# Altium project Ravage.PrjPcb (part 2 of 2)

## Sheet Core Analogue Inputs.SchDoc: Ravage - Core Analogue Inputs
size A4; Address1: Drawn By:; Address2: Dan Visser; DocumentNumber: A; Revision: 0.1-alpha; SheetNumber: 6; SheetTotal: 16
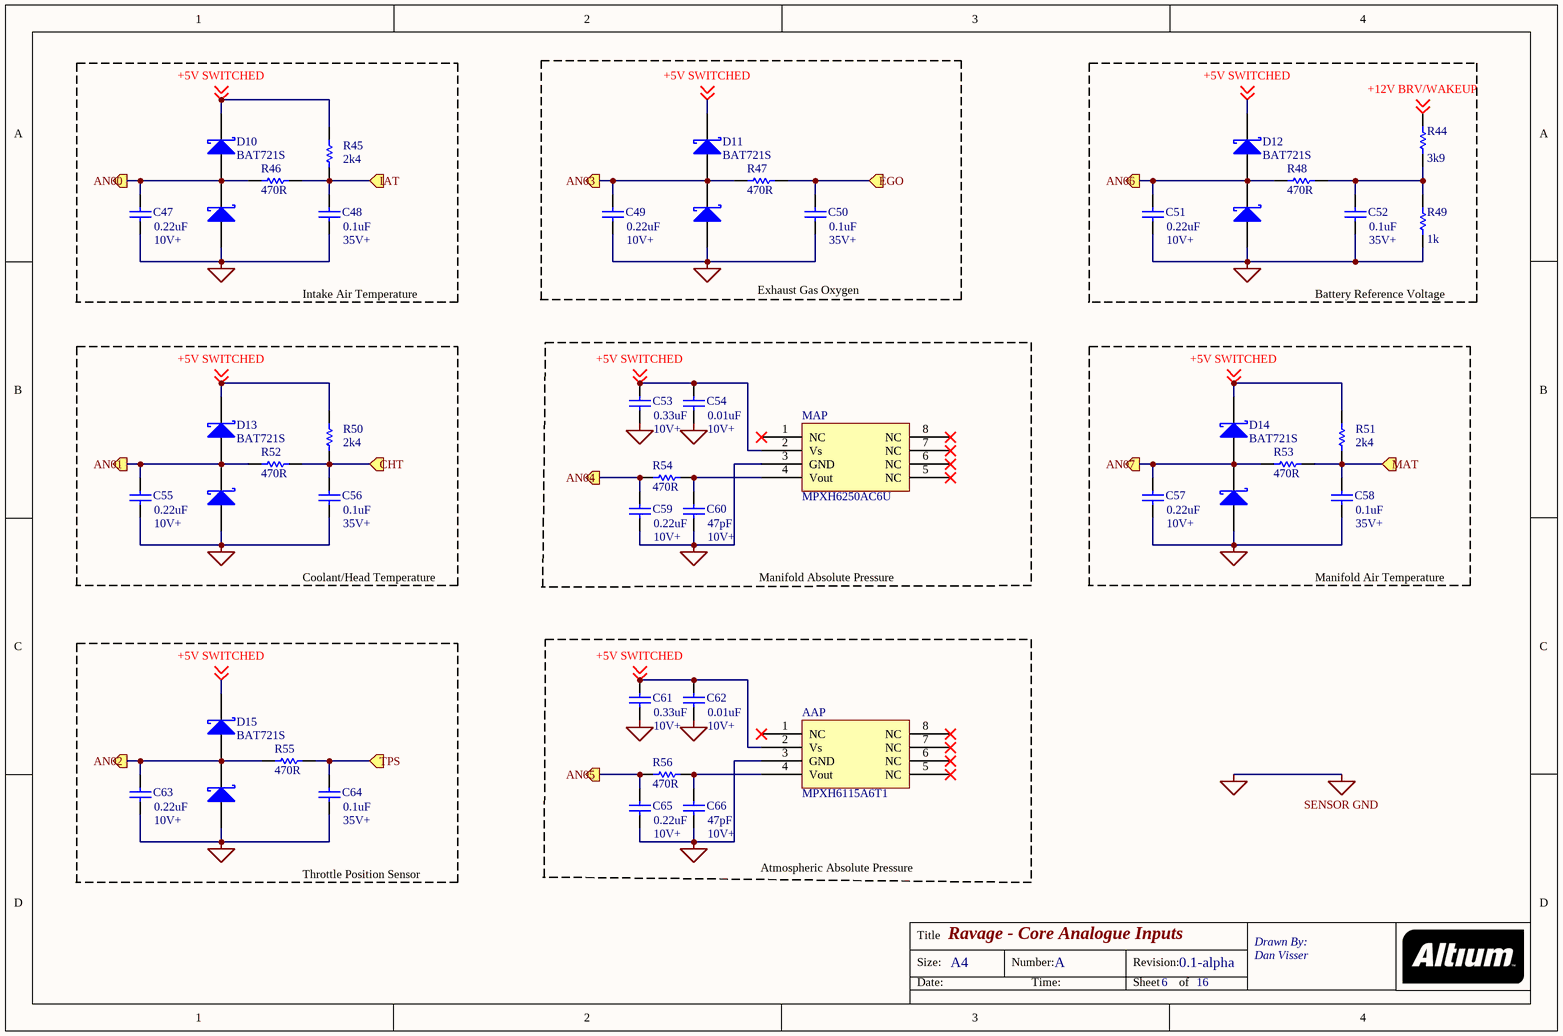
[diagram p10: Core Analogue Inputs.SchDoc]

### Parts
AAP  MPXH6115A6T1
C47  value 0.22uF  [RAD-0.3]
C48  value 0.1uF  [RAD-0.3]
C49  value 0.22uF  [RAD-0.3]
C50  value 0.1uF  [RAD-0.3]
C51  value 0.22uF  [RAD-0.3]
C52  value 0.1uF  [RAD-0.3]
C53  value 0.33uF  [RAD-0.3]
C54  value 0.01uF  [RAD-0.3]
C55  value 0.22uF  [RAD-0.3]
C56  value 0.1uF  [RAD-0.3]
C57  value 0.22uF  [RAD-0.3]
C58  value 0.1uF  [RAD-0.3]
C59  value 0.22uF  [RAD-0.3]
C60  value 47pF  [RAD-0.3]
C61  value 0.33uF  [RAD-0.3]
C62  value 0.01uF  [RAD-0.3]
C63  value 0.22uF  [RAD-0.3]
C64  value 0.1uF  [RAD-0.3]
C65  value 0.22uF  [RAD-0.3]
C66  value 47pF  [RAD-0.3]
D10  BAT721S
D11  BAT721S
D12  BAT721S
D13  BAT721S
D14  BAT721S
D15  BAT721S
MAP  MPXH6250AC6U
R44  value 3k9  [AXIAL-0.3]
R45  value 2k4  [AXIAL-0.3]
R46  value 470R  [AXIAL-0.3]
R47  value 470R  [AXIAL-0.3]
R48  value 470R  [AXIAL-0.3]
R49  value 1k  [AXIAL-0.3]
R50  value 2k4  [AXIAL-0.3]
R51  value 2k4  [AXIAL-0.3]
R52  value 470R  [AXIAL-0.3]
R53  value 470R  [AXIAL-0.3]
R54  value 470R  [AXIAL-0.3]
R55  value 470R  [AXIAL-0.3]
R56  value 470R  [AXIAL-0.3]

### Ports
AN00 (out), AN01 (out), AN02 (out), AN03 (out), AN04 (out), AN05 (out), AN06 (out), AN07 (out), CHT (in), EGO (in), IAT (in), MAT (in), TPS (in)

### Nets
SENSOR GND: AAP.3(GND) C47.1 C48.1 C49.1 C50.1 C51.1 C52.1 C53.1 C54.1 C55.1 C56.1 C57.1 C58.1 C59.1 C60.1 C61.1 C62.1 C63.1 C64.1 C65.1 C66.1 D10.1(A) D11.1(A) D12.1(A) D13.1(A) D14.1(A) D15.1(A) MAP.3(GND) R49.1
+5V SWITCHED: AAP.2(Vs) C53.2 C54.2 C61.2 C62.2 D10.2(K) D11.2(K) D12.2(K) D13.2(K) D14.2(K) D15.2(K) MAP.2(Vs) R45.1 R50.1 R51.1 ; off-sheet +5V SWITCHED
+12V BRV/WAKEUP: R44.2 ; off-sheet +12V BRV/WAKEUP
AN00: C47.2 D10.3(A2) R46.1 ; port AN00
AN01: C55.2 D13.3(A2) R52.1 ; port AN01
AN02: C63.2 D15.3(A2) R55.1 ; port AN02
AN03: C49.2 D11.3(A2) R47.1 ; port AN03
AN04: C59.2 R54.1 ; port AN04
AN05: C65.2 R56.1 ; port AN05
AN06: C51.2 D12.3(A2) R48.1 ; port AN06
AN07: C57.2 D14.3(A2) R53.1 ; port AN07
CHT: C56.2 R50.2 R52.2 ; port CHT
EGO: C50.2 R47.2 ; port EGO
IAT: C48.2 R45.2 R46.2 ; port IAT
MAT: C58.2 R51.2 R53.2 ; port MAT
TPS: C64.2 R55.2 ; port TPS
NetAAP_4: AAP.4(Vout) C66.2 R56.2
NetC52_2: C52.2 R44.1 R48.2 R49.2
NetC60_2: C60.2 MAP.4(Vout) R54.2

Not connected (* = marked no-connect by the designer): AAP 1(NC)* 5(NC)* 6(NC)* 7(NC)* 8(NC)*; MAP 1(NC)* 5(NC)* 6(NC)* 7(NC)* 8(NC)*

### Notes on the sheet
- (near C47) 10V+
- (near C48) 35V+
- (near C49) 10V+
- (near C50) 35V+
- (near C51) 10V+
- 35V+
- Intake Air Temperature
- Exhaust Gas Oxygen
- Battery Reference Voltage
- 10V+
- (near C54) 10V+
- (near C55) 10V+
- Coolant/Head Temperature
- (near C56) 35V+
- (near C60) 10V+
- Manifold Absolute Pressure
- (near C57) 10V+
- Manifold Air Temperature
- (near C58) 35V+
- (near C62) 10V+
- (near C63) 10V+
- (near C64) 35V+
- (near C66) 10V+
- Throttle Position Sensor
- Atmospheric Absolute Pressure
- Title
- Size:
- Date:
- A4
- Number:
- Time:
- Revision:
- Sheet
- of

### Library data of the parts
C47-C66 = Cap: Capacitor; Published: 8-Jun-2000; LatestRevisionDate: 17-Jul-2002; LatestRevisionNote: Re-released for DXP Platform.; PackageReference: RAD-0.3; Publisher: Altium Limited; PackageDescription: Radial Cap, Thru-Hole; 2 Leads; 0.3 in Pin Spacing
D10-D15 = BAT721S: DUAL SCHOTTKY DIODE
R44-R56 = Res1: Resistor; Published: 8-Jun-2000; LatestRevisionDate: 17-Jul-2002; LatestRevisionNote: Re-released for DXP Platform.; PackageReference: AXIAL-0.3; Publisher: Altium Limited; PackageDescription: Axial Device, Thru-Hole; 2 Leads; 0.3 in Pin Spacing

## Sheet Extra Analogue Inputs.SchDoc: Ravage - Extra Analogue Inputs
size A4; Address1: Drawn By:; Address2: Dan Visser; DocumentNumber: A; Revision: 0.1-alpha; SheetNumber: 7; SheetTotal: 16
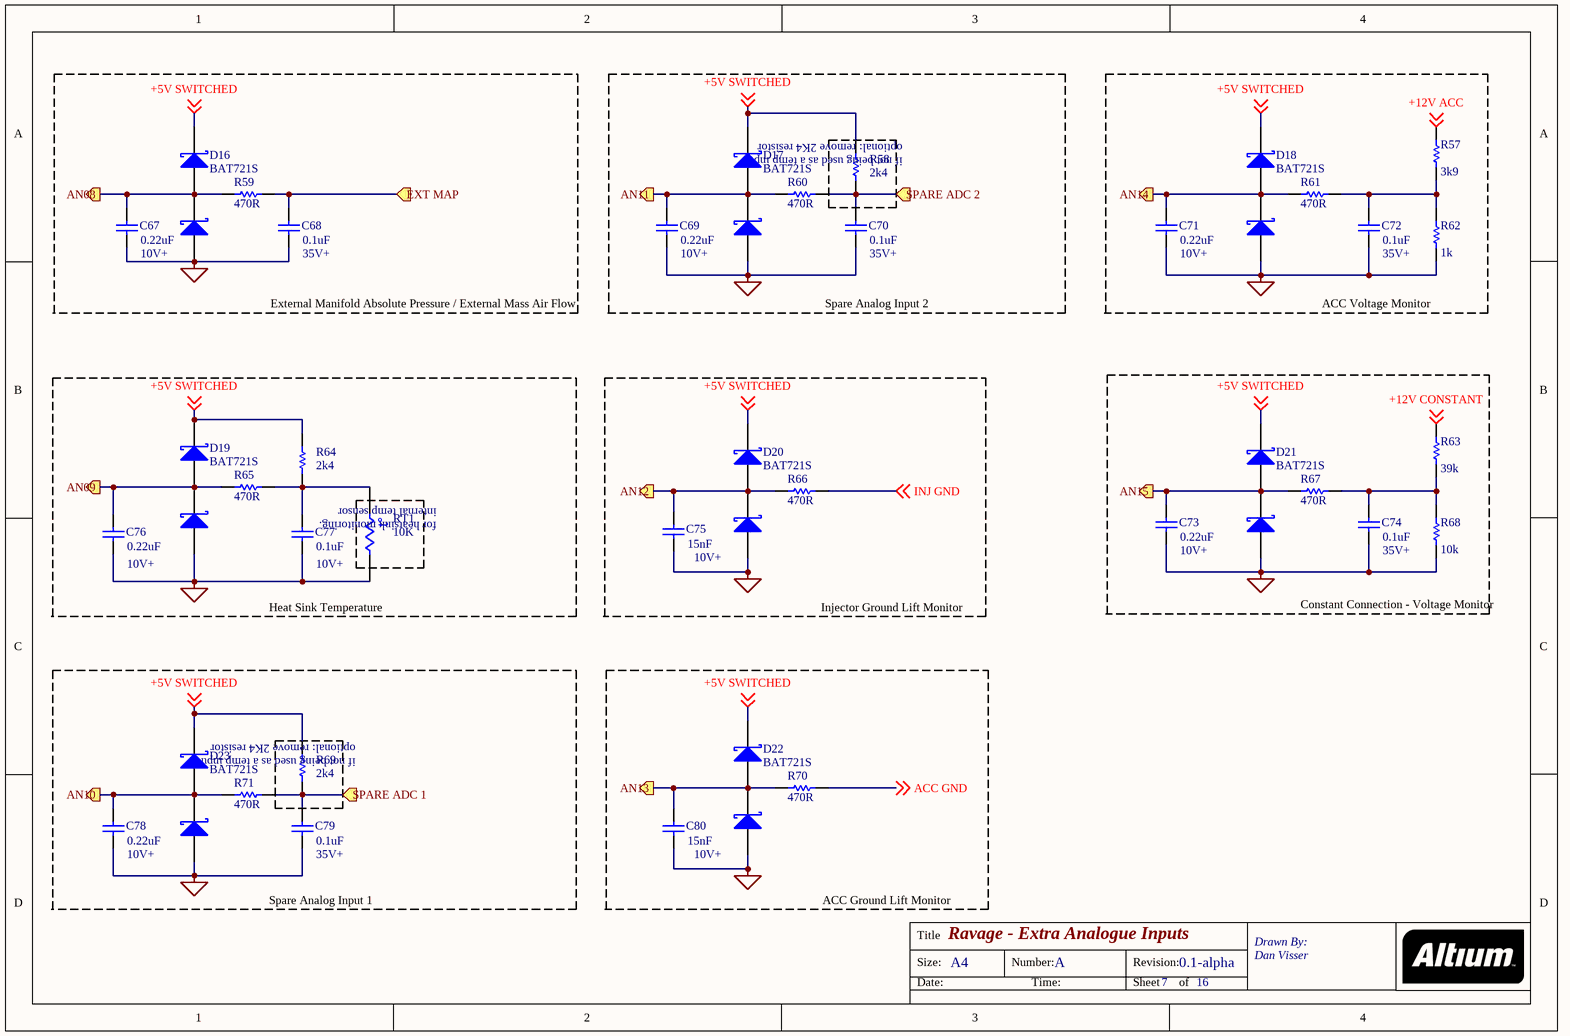
[diagram p11: Extra Analogue Inputs.SchDoc]

### Parts
C67  value 0.22uF  [RAD-0.3]
C68  value 0.1uF  [RAD-0.3]
C69  value 0.22uF  [RAD-0.3]
C70  value 0.1uF  [RAD-0.3]
C71  value 0.22uF  [RAD-0.3]
C72  value 0.1uF  [RAD-0.3]
C73  value 0.22uF  [RAD-0.3]
C74  value 0.1uF  [RAD-0.3]
C75  value 15nF  [RAD-0.3]
C76  value 0.22uF  [RAD-0.3]
C77  value 0.1uF  [RAD-0.3]
C78  value 0.22uF  [RAD-0.3]
C79  value 0.1uF  [RAD-0.3]
C80  value 15nF  [RAD-0.3]
D16  BAT721S
D17  BAT721S
D18  BAT721S
D19  BAT721S
D20  BAT721S
D21  BAT721S
D22  BAT721S
D23  BAT721S
R57  value 3k9  [AXIAL-0.3]
R58  value 2k4  [AXIAL-0.3]
R59  value 470R  [AXIAL-0.3]
R60  value 470R  [AXIAL-0.3]
R61  value 470R  [AXIAL-0.3]
R62  value 1k  [AXIAL-0.3]
R63  value 39k  [AXIAL-0.3]
R64  value 2k4  [AXIAL-0.3]
R65  value 470R  [AXIAL-0.3]
R66  value 470R  [AXIAL-0.3]
R67  value 470R  [AXIAL-0.3]
R68  value 10k  [AXIAL-0.3]
R69  value 2k4  [AXIAL-0.3]
R70  value 470R  [AXIAL-0.3]
R71  value 470R  [AXIAL-0.3]
RT1  10K  [6-0805_N]

### Ports
AN08 (out), AN09 (out), AN10 (out), AN11 (out), AN12 (out), AN13 (out), AN14 (out), AN15 (out), EXT MAP (in), SPARE ADC 1 (in), SPARE ADC 2 (in)

### Nets
SENSOR GND: C67.1 C68.1 C69.1 C70.1 C71.1 C72.1 C73.1 C74.1 C75.1 C76.1 C77.1 C78.1 C79.1 C80.1 D16.1(A) D17.1(A) D18.1(A) D19.1(A) D20.1(A) D21.1(A) D22.1(A) D23.1(A) R62.1 R68.1 RT1.2
+5V SWITCHED: D16.2(K) D17.2(K) D18.2(K) D19.2(K) D20.2(K) D21.2(K) D22.2(K) D23.2(K) R58.1 R64.1 R69.1 ; off-sheet +5V SWITCHED
+12V ACC: R57.2 ; off-sheet +12V ACC
+12V CONSTANT: R63.2 ; off-sheet +12V CONSTANT
ACC GND: R70.2 ; off-sheet ACC GND
AN08: C67.2 D16.3(A2) R59.1 ; port AN08
AN09: C76.2 D19.3(A2) R65.1 ; port AN09
AN10: C78.2 D23.3(A2) R71.1 ; port AN10
AN11: C69.2 D17.3(A2) R60.1 ; port AN11
AN12: C75.2 D20.3(A2) R66.1 ; port AN12
AN13: C80.2 D22.3(A2) R70.1 ; port AN13
AN14: C71.2 D18.3(A2) R61.1 ; port AN14
AN15: C73.2 D21.3(A2) R67.1 ; port AN15
EXT MAP: C68.2 R59.2 ; port EXT MAP
INJ GND: R66.2 ; off-sheet INJ GND
SPARE ADC 1: C79.2 R69.2 R71.2 ; port SPARE ADC 1
SPARE ADC 2: C70.2 R58.2 R60.2 ; port SPARE ADC 2
NetC72_2: C72.2 R57.1 R61.2 R62.2
NetC74_2: C74.2 R63.1 R67.2 R68.2
NetC77_2: C77.2 R64.2 R65.2 RT1.1

### Notes on the sheet
- (near R58) optional: remove 2K4 resistor
- if not being used as a temp input.
- 10V+
- External Manifold Absolute Pressure / External Mass Air Flow
- (near C68) 35V+
- (near C69) 10V+
- Spare Analog Input 2
- (near C70) 35V+
- (near C71) 10V+
- ACC Voltage Monitor
- 35V+
- internal temp sensor
- for heatsink monitoring.
- (near C76) 10V+
- (near C73) 10V+
- Heat Sink Temperature
- Injector Ground Lift Monitor
- Constant Connection - Voltage Monitor
- optional: remove 2K4 resistor
- (near C78) 10V+
- Spare Analog Input 1
- (near C79) 35V+
- ACC Ground Lift Monitor
- Title
- Size:
- Date:
- A4
- Number:
- Time:
- Revision:
- Sheet
- of
- (in symbol Res Thermal) t°

### Library data of the parts
C67-C80 = Cap: Capacitor; Published: 8-Jun-2000; LatestRevisionDate: 17-Jul-2002; LatestRevisionNote: Re-released for DXP Platform.; PackageReference: RAD-0.3; Publisher: Altium Limited; PackageDescription: Radial Cap, Thru-Hole; 2 Leads; 0.3 in Pin Spacing
D16-D23 = BAT721S: DUAL SCHOTTKY DIODE
R57-R71 = Res1: Resistor; Published: 8-Jun-2000; LatestRevisionDate: 17-Jul-2002; LatestRevisionNote: Re-released for DXP Platform.; PackageReference: AXIAL-0.3; Publisher: Altium Limited; PackageDescription: Axial Device, Thru-Hole; 2 Leads; 0.3 in Pin Spacing
RT1 = Res Thermal: Thermistor; Published: 24-Mar-1999; LatestRevisionDate: 29-May-2009; LatestRevisionNote: IPC-7351 Footprint Added.; PackageVersion: Mar-2003; PackageReference: 6-0805; Publisher: Altium Limited; PackageDescription: Chip Resistor 0805 Case Size; Code_IPC: RESC2012

## Sheet Low Side Drivers.SchDoc: Ravage - Low Side Drivers
size A4; Address1: Drawn By:; Address2: Dan Visser; DocumentNumber: A; Revision: 0.1-alpha; SheetNumber: 12; SheetTotal: 16
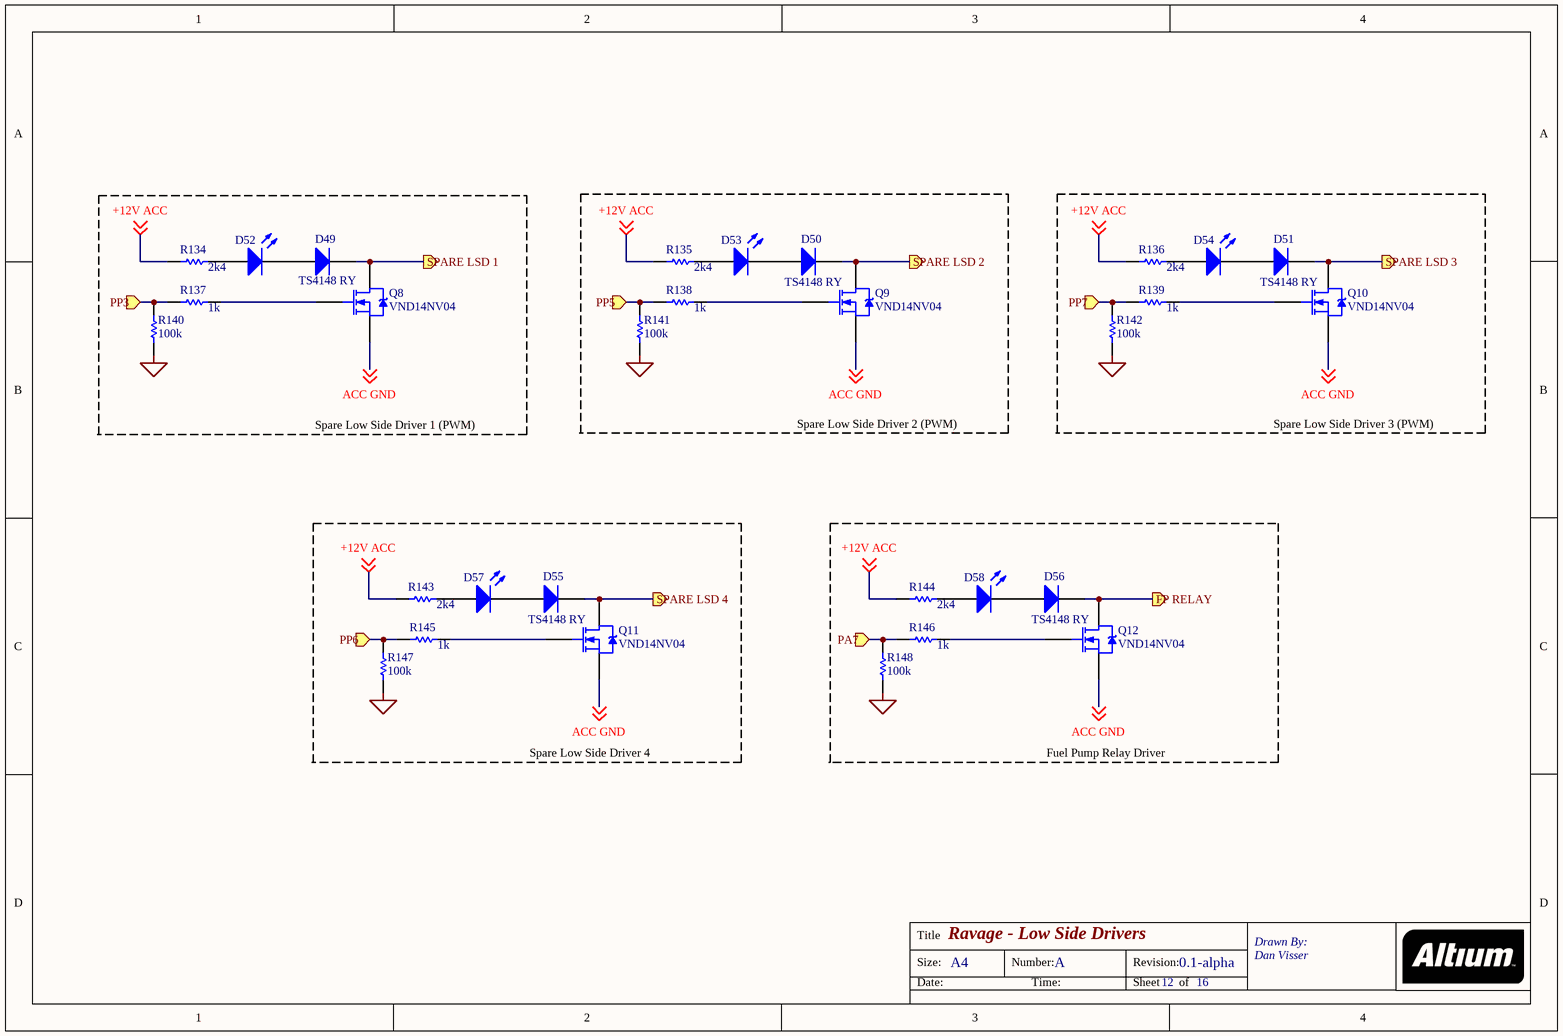
[diagram p12: Low Side Drivers.SchDoc]

### Parts
D49  TS4148 RY  [SMC]
D50  TS4148 RY  [SMC]
D51  TS4148 RY  [SMC]
D52  (no value)  [LED-0]
D53  (no value)  [LED-0]
D54  (no value)  [LED-0]
D55  TS4148 RY  [SMC]
D56  TS4148 RY  [SMC]
D57  (no value)  [LED-0]
D58  (no value)  [LED-0]
Q8  VND14NV04  [TO-220AB]
Q9  VND14NV04  [TO-220AB]
Q10  VND14NV04  [TO-220AB]
Q11  VND14NV04  [TO-220AB]
Q12  VND14NV04  [TO-220AB]
R134  value 2k4  [AXIAL-0.3]
R135  value 2k4  [AXIAL-0.3]
R136  value 2k4  [AXIAL-0.3]
R137  value 1k  [AXIAL-0.3]
R138  value 1k  [AXIAL-0.3]
R139  value 1k  [AXIAL-0.3]
R140  value 100k  [AXIAL-0.3]
R141  value 100k  [AXIAL-0.3]
R142  value 100k  [AXIAL-0.3]
R143  value 2k4  [AXIAL-0.3]
R144  value 2k4  [AXIAL-0.3]
R145  value 1k  [AXIAL-0.3]
R146  value 1k  [AXIAL-0.3]
R147  value 100k  [AXIAL-0.3]
R148  value 100k  [AXIAL-0.3]

### Blocks framed on the sheet
Spare Low Side Driver 2 (PWM): D50 D53 Q9 R135 R138 R141
Spare Low Side Driver 3 (PWM): D51 D54 Q10 R136 R139 R142
Spare Low Side Driver 1 (PWM): D49 D52 Q8 R134 R137 R140
Spare Low Side Driver 4: D55 D57 Q11 R143 R145 R147
Fuel Pump Relay Driver: D56 D58 Q12 R144 R146 R148

### Ports
FP RELAY (out), PA7 (in), PP3 (in), PP5 (in), PP6 (in), PP7 (in), SPARE LSD 1 (out), SPARE LSD 2 (out), SPARE LSD 3 (out), SPARE LSD 4 (out)

### Nets
SENSOR GND: R140.1 R141.1 R142.1 R147.1 R148.1
+12V ACC: R134.1 R135.1 R136.1 R143.1 R144.1 ; off-sheet +12V ACC
ACC GND: Q8.3(S) Q9.3(S) Q10.3(S) Q11.3(S) Q12.3(S) ; off-sheet ACC GND
FP RELAY: D56.2(K) Q12.2(D) ; port FP RELAY
PA7: R146.1 R148.2 ; port PA7
PP3: R137.1 R140.2 ; port PP3
PP5: R138.1 R141.2 ; port PP5
PP6: R145.1 R147.2 ; port PP6
PP7: R139.1 R142.2 ; port PP7
SPARE LSD 1: D49.2(K) Q8.2(D) ; port SPARE LSD 1
SPARE LSD 2: D50.2(K) Q9.2(D) ; port SPARE LSD 2
SPARE LSD 3: D51.2(K) Q10.2(D) ; port SPARE LSD 3
SPARE LSD 4: D55.2(K) Q11.2(D) ; port SPARE LSD 4
NetD49_1: D49.1(A) D52.2(K)
NetD50_1: D50.1(A) D53.2(K)
NetD51_1: D51.1(A) D54.2(K)
NetD52_1: D52.1(A) R134.2
NetD53_1: D53.1(A) R135.2
NetD54_1: D54.1(A) R136.2
NetD55_1: D55.1(A) D57.2(K)
NetD56_1: D56.1(A) D58.2(K)
NetD57_1: D57.1(A) R143.2
NetD58_1: D58.1(A) R144.2
NetQ8_1: Q8.1(G) R137.2
NetQ9_1: Q9.1(G) R138.2
NetQ10_1: Q10.1(G) R139.2
NetQ11_1: Q11.1(G) R145.2
NetQ12_1: Q12.1(G) R146.2

### Notes on the sheet
- Title
- Size:
- Date:
- A4
- Number:
- Time:
- Revision:
- Sheet
- of

### Library data of the parts
D49-D51 D55 D56 = Diode: Default Diode; Published: 8-Jun-2000; LatestRevisionDate: 17-Jul-2002; LatestRevisionNote: Re-released for DXP Platform.; PackageVersion: Sep-1996; PackageReference: SMC; Publisher: Altium Limited; PackageDescription: DO-214-AB/SMC; 2 C-Bend Leads; Body 7.9 x 5.9 mm, inc. leads (LxW); Code_JEDEC: DO-214-AB
D52-D54 D57 D58 = LED0: Typical INFRARED GaAs LED; Published: 8-Jun-2000; LatestRevisionDate: 08-Jul-2005; LatestRevisionNote: Mech Layer 1 removed.; PackageReference: LED-0; Publisher: Altium Limited; PackageDescription: LED; 2 Leads
Q8-Q12 = IRL520N: HEXFET Power MOSFET; Note: Pin 2 is electrically connected to pin 4 (Drain).; Published: 8-Jun-2000; LatestRevisionDate: 17-Jul-2002; LatestRevisionNote: Re-released for DXP Platform.; DatasheetVersion: May-1998; PackageVersion: Feb-1997; PackageReference: TO-220AB; Publisher: Altium Limited; PackageDescription: TO, Thru-Hole, Vertical, Heatsink Mounted; 3 In-Line Leads; Pitch 2.54 mm; ComponentLink1Description: Manufacturer Link; ComponentLink1URL: http://www.irf.com/; ComponentLink2Description: Datasheet; ComponentLink2URL: http://www.irf.com/product-info/datasheets/data/irl520n.pdf
R134-R148 = Res1: Resistor; Published: 8-Jun-2000; LatestRevisionDate: 17-Jul-2002; LatestRevisionNote: Re-released for DXP Platform.; PackageReference: AXIAL-0.3; Publisher: Altium Limited; PackageDescription: Axial Device, Thru-Hole; 2 Leads; 0.3 in Pin Spacing

## Sheet Knock Sensing.SchDoc: Ravage - Knock Sensing
size A4; Address1: Drawn By:; Address2: Dan Visser; DocumentNumber: A; Revision: 0.1-alpha; SheetNumber: 9; SheetTotal: 16
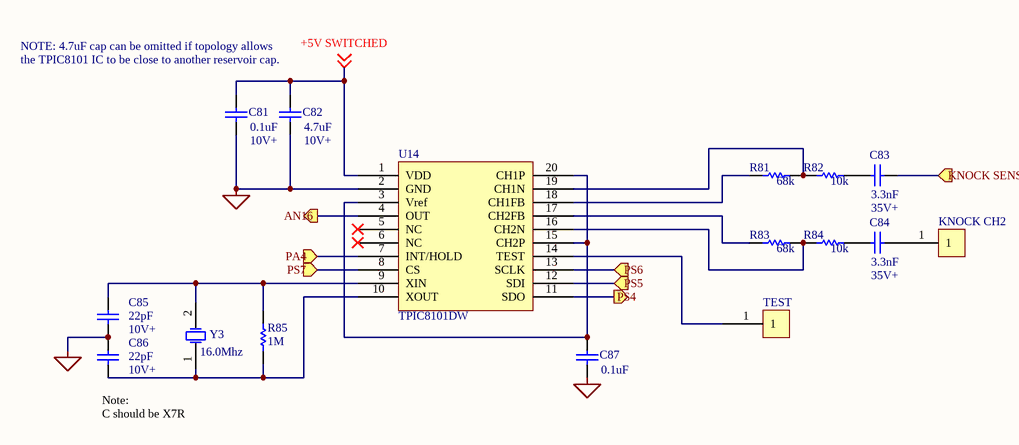
[diagram p13: Knock Sensing.SchDoc]

### Parts
C81  value 0.1uF  [RAD-0.3]
C82  value 4.7uF  [RAD-0.3]
C83  value 3.3nF  [RAD-0.3]
C84  value 3.3nF  [RAD-0.3]
C85  value 22pF  [RAD-0.3]
C86  value 22pF  [RAD-0.3]
C87  value 0.1uF  [RAD-0.3]
KNOCK_CH2  (no value)
R81  value 68k  [AXIAL-0.3]
R82  value 10k  [AXIAL-0.3]
R83  value 68k  [AXIAL-0.3]
R84  value 10k  [AXIAL-0.3]
R85  value 1M  [AXIAL-0.3]
TEST  (no value)
U14  TPIC8101DW  [SOIC20_N]
Y3  16.0Mhz  [R38]

### Ports
AN16 (out), KNOCK SENSOR (in), PA4 (in), PS4 (out), PS5 (in), PS6 (in), PS7 (in)

### Nets
SENSOR GND: C81.1 C82.1 C85.1 C86.2 C87.1 U14.2(GND)
+5V SWITCHED: C81.2 C82.2 U14.1(VDD) ; off-sheet +5V SWITCHED
AN16: U14.4(OUT) ; port AN16
KNOCK SENSOR: C83.2 ; port KNOCK SENSOR
PA4: U14.7(INT/HOLD) ; port PA4
PS4: U14.11(SDO) ; port PS4
PS5: U14.12(SDI) ; port PS5
PS6: U14.13(SCLK) ; port PS6
PS7: U14.8(CS) ; port PS7
NetC83_1: C83.1 R82.2
NetC84_1: C84.1 R84.2
NetC84_2: C84.2 KNOCK_CH2.1
NetC85_2: C85.2 R85.1 U14.9(XIN) Y3.2(OSC2)
NetC86_1: C86.1 R85.2 U14.10(XOUT) Y3.1(OSC1)
NetC87_2: C87.2 U14.3(Vref) U14.15(CH2P) U14.20(CH1P)
NetR81_1: R81.1 U14.18(CH1FB)
NetR81_2: R81.2 R82.1 U14.19(CH1N)
NetR83_1: R83.1 U14.17(CH2FB)
NetR83_2: R83.2 R84.1 U14.16(CH2N)
NetTEST_1: TEST.1 U14.14(TEST)

Not connected (* = marked no-connect by the designer): U14 5(NC)* 6(NC)*

### Notes on the sheet
- NOTE: 4.7uF cap can be omitted if topology allows
- the TPIC8101 IC to be close to another reservoir cap.
- 10V+
- (near C82) 10V+
- 35V+
- (near C86) 10V+
- Note:
  C should be X7R
- Title
- Size:
- Date:
- A4
- Number:
- Time:
- Revision:
- Sheet
- of

### Library data of the parts
C81-C87 = Cap: Capacitor; Published: 8-Jun-2000; LatestRevisionDate: 17-Jul-2002; LatestRevisionNote: Re-released for DXP Platform.; PackageReference: RAD-0.3; Publisher: Altium Limited; PackageDescription: Radial Cap, Thru-Hole; 2 Leads; 0.3 in Pin Spacing
KNOCK_CH2 TEST = HEADER 1
R81-R85 = Res1: Resistor; Published: 8-Jun-2000; LatestRevisionDate: 17-Jul-2002; LatestRevisionNote: Re-released for DXP Platform.; PackageReference: AXIAL-0.3; Publisher: Altium Limited; PackageDescription: Axial Device, Thru-Hole; 2 Leads; 0.3 in Pin Spacing
Y3 = XTAL: Crystal Oscillator; Published: 8-Jun-2000; LatestRevisionDate: 17-Jul-2002; LatestRevisionNote: Re-released for DXP Platform.; PackageReference: R38; Publisher: Altium Limited; PackageDescription: Crystal, Thru-Hole; 2 Leads; Body 3.1 x 8.2 mm (Dia.xH)

## Sheet SD Card Interface.SchDoc: Ravage - SD Card Interface
size A4; Address1: Drawn By:; Address2: Dan Visser; DocumentNumber: A; Revision: 0.1-alpha; SheetNumber: 14; SheetTotal: 16
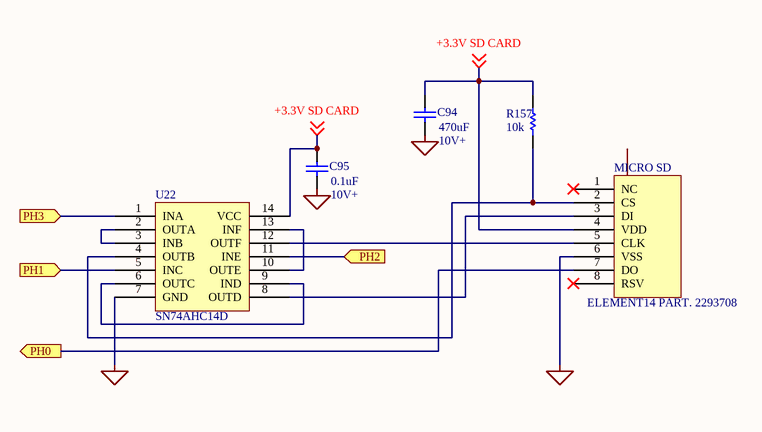
[diagram p14: SD Card Interface.SchDoc]

### Parts
C94  value 470uF  [RAD-0.3]
C95  value 0.1uF  [RAD-0.3]
MICRO_SD  ELEMENT14 PART. 2293708
R157  value 10k  [AXIAL-0.3]
U22  SN74AHC14D

### Ports
PH0 (out), PH1 (in), PH2 (in), PH3 (in)

### Nets
SENSOR GND: C94.1 C95.1 MICRO_SD.6(VSS) U22.7(GND)
+3.3V SD CARD: C94.2 C95.2 MICRO_SD.4(VDD) R157.2 U22.14(VCC) ; off-sheet +3.3V SD CARD
PH0: MICRO_SD.7(DO) ; port PH0
PH1: U22.5(INC) ; port PH1
PH2: U22.11(INE) ; port PH2
PH3: U22.1(INA) ; port PH3
NetMICRO_SD_2: MICRO_SD.2(CS) R157.1 U22.4(OUTB)
NetMICRO_SD_3: MICRO_SD.3(DI) U22.8(OUTD)
NetMICRO_SD_5: MICRO_SD.5(CLK) U22.12(OUTF)
NetU22_2: U22.2(OUTA) U22.3(INB)
NetU22_6: U22.6(OUTC) U22.9(IND)
NetU22_10: U22.10(OUTE) U22.13(INF)

Not connected (* = marked no-connect by the designer): MICRO_SD 1(NC)* 8(RSV)*

### Notes on the sheet
- (near C94) 10V+
- (near C95) 10V+
- Title
- Size:
- Date:
- A4
- Number:
- Time:
- Revision:
- Sheet
- of

### Library data of the parts
C94 C95 = Cap: Capacitor; Published: 8-Jun-2000; LatestRevisionDate: 17-Jul-2002; LatestRevisionNote: Re-released for DXP Platform.; PackageReference: RAD-0.3; Publisher: Altium Limited; PackageDescription: Radial Cap, Thru-Hole; 2 Leads; 0.3 in Pin Spacing
MICRO_SD = ELEMENT14 PART. 1764377
R157 = Res1: Resistor; Published: 8-Jun-2000; LatestRevisionDate: 17-Jul-2002; LatestRevisionNote: Re-released for DXP Platform.; PackageReference: AXIAL-0.3; Publisher: Altium Limited; PackageDescription: Axial Device, Thru-Hole; 2 Leads; 0.3 in Pin Spacing
U22 = SN74AHC14N

## Sheet IO Expansion Header.SchDoc: Ravage - IO Expansion Header
size A4; Address1: Drawn By:; Address2: Dan Visser; DocumentNumber: A; Revision: 0.1-alpha; SheetNumber: 15; SheetTotal: 16
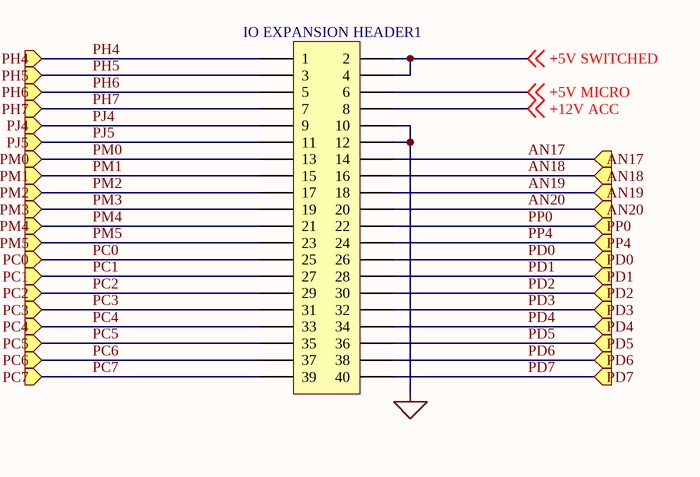
[diagram p15: IO Expansion Header.SchDoc]

### Parts
IO_EXPANSION_HEADER1  (no value)  [HDR2X20]

### Ports
AN17 (in), AN18 (in), AN19 (in), AN20 (in), PC0 (in), PC1 (in), PC2 (in), PC3 (in), PC4 (in), PC5 (in), PC6 (in), PC7 (in), PD0 (in), PD1 (in), PD2 (in), PD3 (in), PD4 (in), PD5 (in), PD6 (in), PD7 (in), PH4 (in), PH5 (in), PH6 (in), PH7 (in), PJ4 (in), PJ5 (in), PM0 (in), PM1 (in), PM2 (in), PM3 (in), PM4 (in), PM5 (in), PP0 (in), PP4 (in)

### Nets
SENSOR GND: IO_EXPANSION_HEADER1.10 IO_EXPANSION_HEADER1.12
+5V MICRO: IO_EXPANSION_HEADER1.6 ; off-sheet +5V MICRO
+5V SWITCHED: IO_EXPANSION_HEADER1.2 IO_EXPANSION_HEADER1.4 ; off-sheet +5V SWITCHED
+12V ACC: IO_EXPANSION_HEADER1.8 ; off-sheet +12V ACC
AN17: IO_EXPANSION_HEADER1.14 ; port AN17
AN18: IO_EXPANSION_HEADER1.16 ; port AN18
AN19: IO_EXPANSION_HEADER1.18 ; port AN19
AN20: IO_EXPANSION_HEADER1.20 ; port AN20
PC0: IO_EXPANSION_HEADER1.25 ; port PC0
PC1: IO_EXPANSION_HEADER1.27 ; port PC1
PC2: IO_EXPANSION_HEADER1.29 ; port PC2
PC3: IO_EXPANSION_HEADER1.31 ; port PC3
PC4: IO_EXPANSION_HEADER1.33 ; port PC4
PC5: IO_EXPANSION_HEADER1.35 ; port PC5
PC6: IO_EXPANSION_HEADER1.37 ; port PC6
PC7: IO_EXPANSION_HEADER1.39 ; port PC7
PD0: IO_EXPANSION_HEADER1.26 ; port PD0
PD1: IO_EXPANSION_HEADER1.28 ; port PD1
PD2: IO_EXPANSION_HEADER1.30 ; port PD2
PD3: IO_EXPANSION_HEADER1.32 ; port PD3
PD4: IO_EXPANSION_HEADER1.34 ; port PD4
PD5: IO_EXPANSION_HEADER1.36 ; port PD5
PD6: IO_EXPANSION_HEADER1.38 ; port PD6
PD7: IO_EXPANSION_HEADER1.40 ; port PD7
PH4: IO_EXPANSION_HEADER1.1 ; port PH4
PH5: IO_EXPANSION_HEADER1.3 ; port PH5
PH6: IO_EXPANSION_HEADER1.5 ; port PH6
PH7: IO_EXPANSION_HEADER1.7 ; port PH7
PJ4: IO_EXPANSION_HEADER1.9 ; port PJ4
PJ5: IO_EXPANSION_HEADER1.11 ; port PJ5
PM0: IO_EXPANSION_HEADER1.13 ; port PM0
PM1: IO_EXPANSION_HEADER1.15 ; port PM1
PM2: IO_EXPANSION_HEADER1.17 ; port PM2
PM3: IO_EXPANSION_HEADER1.19 ; port PM3
PM4: IO_EXPANSION_HEADER1.21 ; port PM4
PM5: IO_EXPANSION_HEADER1.23 ; port PM5
PP0: IO_EXPANSION_HEADER1.22 ; port PP0
PP4: IO_EXPANSION_HEADER1.24 ; port PP4

### Notes on the sheet
- Title
- Size:
- Date:
- A4
- Number:
- Time:
- Revision:
- Sheet
- of

### Library data of the parts
IO_EXPANSION_HEADER1 = Header 20X2: Header, 20-Pin, Dual row; LatestRevisionDate: 17-Jul-2002; LatestRevisionNote: Re-released for DXP Platform.; Publisher: Altium Limited

## Nets that join several sheets
SENSOR GND: CPU (33 pins), Ignitor Outputs (25 pins), Injectors (6 pins), Digital Inputs (9 pins), USB Comms (U8.4), 3-Wire ISCV Driver (R151.1 R156.1 U21.3), Power Supplies (18 pins), VR Interfaces (20 pins), Connector (CON1.6 CON1.14 CON2.2), RS232 Comms (C32.1 C36.1 JP2.2 U9.15), Core Analogue Inputs (29 pins), Extra Analogue Inputs (25 pins), Low Side Drivers (5 pins), Knock Sensing (6 pins), SD Card Interface (C94.1 C95.1 MICRO_SD.6 U22.7), IO Expansion Header (IO_EXPANSION_HEADER1.10 IO_EXPANSION_HEADER1.12)
+5V AUX: Power Supplies (F2.2), Connector (CON1.10)
+5V MICRO: CPU (23 pins), IO Expansion Header (IO_EXPANSION_HEADER1.6)
+5V SWITCHED: CPU (C13.2 U1.108), IO Expansion Header (IO_EXPANSION_HEADER1.2 IO_EXPANSION_HEADER1.4)
+5V TPS: Power Supplies (F1.2), Connector (CON1.9)
AN00: CPU (U1.89), Core Analogue Inputs (C47.2 D10.3 R46.1)
AN01: CPU (U1.91), Core Analogue Inputs (C55.2 D13.3 R52.1)
AN02: CPU (U1.93), Core Analogue Inputs (C63.2 D15.3 R55.1)
AN03: CPU (U1.95), Core Analogue Inputs (C49.2 D11.3 R47.1)
AN04: CPU (U1.97), Core Analogue Inputs (C59.2 R54.1)
AN05: CPU (U1.99), Core Analogue Inputs (C65.2 R56.1)
AN06: CPU (U1.101), Core Analogue Inputs (C51.2 D12.3 R48.1)
AN07: CPU (U1.103), Core Analogue Inputs (C57.2 D14.3 R53.1)
AN08: CPU (U1.90), Extra Analogue Inputs (C67.2 D16.3 R59.1)
AN09: CPU (U1.92), Extra Analogue Inputs (C76.2 D19.3 R65.1)
AN10: CPU (U1.94), Extra Analogue Inputs (C78.2 D23.3 R71.1)
AN11: CPU (U1.96), Extra Analogue Inputs (C69.2 D17.3 R60.1)
AN12: CPU (U1.98), Extra Analogue Inputs (C75.2 D20.3 R66.1)
AN13: CPU (U1.100), Extra Analogue Inputs (C80.2 D22.3 R70.1)
AN14: CPU (U1.102), Extra Analogue Inputs (C71.2 D18.3 R61.1)
AN15: CPU (U1.104), Extra Analogue Inputs (C73.2 D21.3 R67.1)
AN16: CPU (U1.105), Knock Sensing (U14.4)
CHT: Connector (CON1.15), Core Analogue Inputs (C56.2 R50.2 R52.2)
CPU RXD0: CPU (U1.119), USB Comms (U8.2)
CPU RXD1: CPU (U1.121), RS232 Comms (U9.12)
CPU TXD0: CPU (U1.120), USB Comms (U8.3)
CPU TXD1: CPU (U1.122), RS232 Comms (U9.11)
EGO: Connector (CON1.12), Core Analogue Inputs (C50.2 R47.2)
EXT MAP: Connector (CON1.11), Extra Analogue Inputs (C68.2 R59.2)
FP RELAY: Connector (CON1.28), Low Side Drivers (D56.2 Q12.2)
IAT: Connector (CON1.13), Core Analogue Inputs (C48.2 R45.2 R46.2)
IGNITOR 1: Ignitor Outputs (R88.2), Connector (CON1.21)
IGNITOR 2: Ignitor Outputs (R89.2), Connector (CON1.22)
IGNITOR 3: Ignitor Outputs (R96.2), Connector (CON1.23)
IGNITOR 4: Ignitor Outputs (R97.2), Connector (CON1.25)
IGNITOR 5: Ignitor Outputs (R104.2), Connector (CON1.26)
IGNITOR 6: Ignitor Outputs (R105.2), Connector (CON1.27)
INJECTOR 1: Injectors (D37.2 Q2.2), Connector (CON1.33)
INJECTOR 2: Injectors (D43.2 Q5.2), Connector (CON1.34)
INJECTOR 3: Injectors (D38.2 Q3.2), Connector (CON1.35)
INJECTOR 4: Injectors (D44.2 Q7.2), Connector (CON1.37)
INJECTOR 5: Injectors (D39.2 Q4.2), Connector (CON1.38)
INJECTOR 6: Injectors (D45.2 Q6.2), Connector (CON1.39)
ISCV INV: 3-Wire ISCV Driver (D61.2 Q14.2), Connector (CON1.40)
ISCV NON-INV: 3-Wire ISCV Driver (D59.2 Q13.2), Connector (CON1.36)
KNOCK SENSOR: Connector (CON2.1), Knock Sensing (C83.2)
MAT: Connector (CON1.17), Core Analogue Inputs (C58.2 R51.2 R53.2)
PA4: CPU (U1.77), Knock Sensing (U14.7)
PA5: CPU (U1.78), Power Supplies (R10.1 U4.2)
PA7: CPU (U1.80), Low Side Drivers (R146.1 R148.2)
PB0: CPU (U1.32), Injectors (R116.1 R119.2)
PB1: CPU (U1.33), Injectors (R128.1 R131.2)
PB2: CPU (U1.34), Injectors (R118.1 R121.2)
PB3: CPU (U1.35), Injectors (R130.1 R133.2)
PB4: CPU (U1.36), Injectors (R117.1 R120.2)
PB5: CPU (U1.37), Injectors (R129.1 R132.2)
PE0: CPU (U1.72), Digital Inputs (R76.2)
PE1: CPU (U1.71), Digital Inputs (R78.2)
PH0: CPU (U1.64), SD Card Interface (MICRO_SD.7)
PH1: CPU (U1.63), SD Card Interface (U22.5)
PH2: CPU (U1.62), SD Card Interface (U22.11)
PH3: CPU (U1.61), SD Card Interface (U22.1)
PJ0: CPU (U1.24), Digital Inputs (R72.2)
PJ1: CPU (U1.23), Digital Inputs (R74.2)
PK4: CPU (U1.22), VR Interfaces (R40.1 R41.1 U11.2 U12.4)
PK5: CPU (U1.21), VR Interfaces (R27.1 R36.1 U10.5 U11.1)
PP1: CPU (U1.3), 3-Wire ISCV Driver (R150.1 R151.2 R153.1)
PP2: CPU (U1.2), 3-Wire ISCV Driver (R155.1 R156.2)
PP3: CPU (U1.1), Low Side Drivers (R137.1 R140.2)
PP5: CPU (U1.143), Low Side Drivers (R138.1 R141.2)
PP6: CPU (U1.142), Low Side Drivers (R145.1 R147.2)
PP7: CPU (U1.141), Low Side Drivers (R139.1 R142.2)
PS4: CPU (U1.123), Knock Sensing (U14.11)
PS5: CPU (U1.124), Knock Sensing (U14.12)
PS6: CPU (U1.125), Knock Sensing (U14.13)
PS7: CPU (U1.126), Knock Sensing (U14.8)
PT0: CPU (U1.11), VR Interfaces (R25.1 R28.1 U10.4)
PT1: CPU (U1.12), VR Interfaces (R34.1 U11.4)
PT2: CPU (U1.13), Ignitor Outputs (R87.2 R90.2), Injectors (R113.1)
PT3: CPU (U1.14), Ignitor Outputs (R86.2 R91.2), Injectors (R125.1)
PT4: CPU (U1.17), Ignitor Outputs (R95.2 R98.2), Injectors (R115.1)
PT5: CPU (U1.18), Ignitor Outputs (R94.2 R99.2), Injectors (R127.1)
PT6: CPU (U1.19), Ignitor Outputs (R103.2 R106.2), Injectors (R114.1)
PT7: CPU (U1.20), Ignitor Outputs (R102.2 R107.2), Injectors (R126.1)
RPM0+: VR Interfaces (R23.1 R24.2 R26.2), Connector (CON1.1)
RPM0-: VR Interfaces (R26.1 R29.2), Connector (CON1.2)
RPM1a+: VR Interfaces (R33.1 R35.2), Connector (CON1.3)
RPM1a-: VR Interfaces (R31.1 R32.2 R33.2), Connector (CON1.4)
RPM1b+: VR Interfaces (R38.1 R39.2 R42.2), Connector (CON1.7)
RPM1b-: VR Interfaces (R42.1 R43.2), Connector (CON1.8)
SPARE ADC 1: Connector (CON1.16), Extra Analogue Inputs (C79.2 R69.2 R71.2)
SPARE ADC 2: Connector (CON1.20), Extra Analogue Inputs (C70.2 R58.2 R60.2)
SPARE DIN 1: Digital Inputs (R73.2), Connector (CON1.18)
SPARE DIN 2: Digital Inputs (R75.2), Connector (CON1.19)
SPARE LSD 1: Connector (CON1.29), Low Side Drivers (D49.2 Q8.2)
SPARE LSD 2: Connector (CON1.30), Low Side Drivers (D50.2 Q9.2)
SPARE LSD 3: Connector (CON1.31), Low Side Drivers (D51.2 Q10.2)
TPS: Connector (CON1.5), Core Analogue Inputs (C64.2 R55.2)